# Altium schematic sheet power_gateway.SchDoc
size A4; SheetNumber: 1; SheetTotal: 2
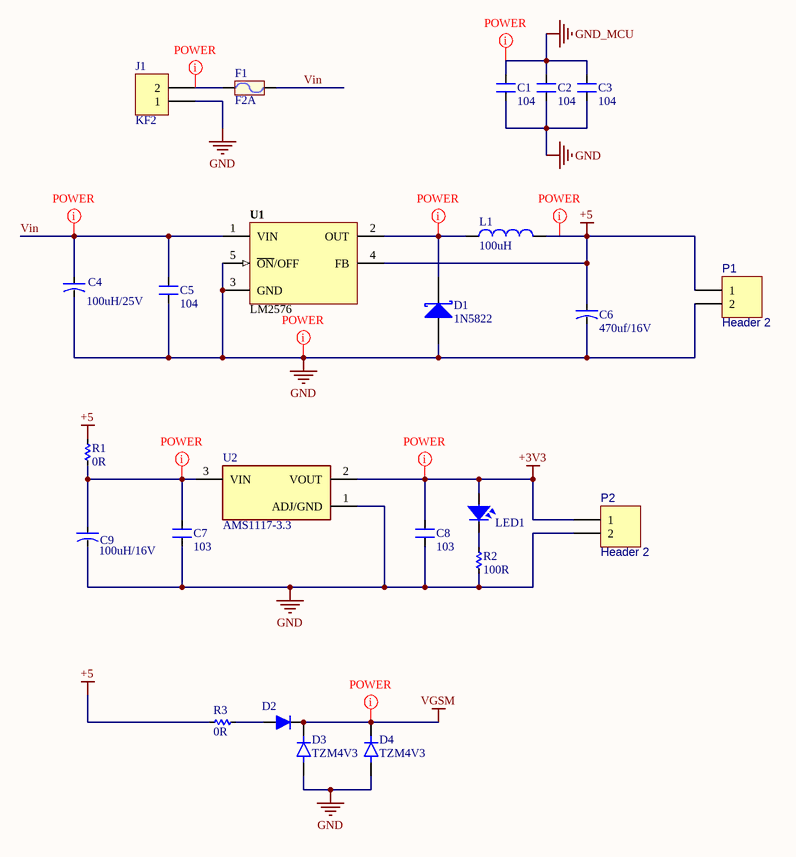
[diagram p0: power_gateway.SchDoc]

## Parts
C1  104  [SM-0805]
C2  104  [SM-0805]
C3  104  [SM-0805]
C4  100uH/25V  [CAP-ALU-SMD-6.3x7.7x2.2]
C5  104  [SM-0805]
C6  470uf/16V  [CAP-ALU-SMD-6.3x7.7x2.2]
C7  103  [SM-0805]
C8  103  [SM-0805]
C9  100uH/16V  [CAP-ALU-SMD-6.3x7.7x2.2]
D1  1N5822  [Diode_SS34]
D2  (no value)  [1N4007_SMD]
D3  TZM4V3  [DIO_LL4148]
D4  TZM4V3  [DIO_LL4148]
F1  F2A  [FUSE2]
J1  KF2  [KF2-5.08]
L1  value 100uH  [inductor_smd]  (hidden comment: Inductor)
LED1  LED  [LED-0805-Green]  (value not drawn)
P1  Header 2  [HDR1X2]
P2  Header 2  [HDR1X2]
R1  0R  [RES-SMD-0805]
R2  100R  [RES-SMD-0805]
R3  0R  [RES-SMD-0805]
U1  LM2576  [TO263]
U2  AMS1117-3.3  [SOT229P700X180-4N]

## Nets
+3V3: C8.1 LED1.1 P2.1 U2.2(VOUT)
+5: C6.1 L1.2 P1.1 R1.1 R3.1 U1.4(FB)
GND: C1.1 C2.1 C3.1 C4.2 C5.2 C6.2 C7.2 C8.2 C9.2 D1.1(A) D3.A D4.A J1.1 P1.2 P2.2 R2.2 U1.3(GND) U1.5(~{ON}/OFF) U2.1(ADJ/GND)
GND_MCU: C1.2 C2.2 C3.2
VGSM: D2.2 D3.C D4.C
Vin: C4.1 C5.1 F1.2 U1.1(VIN)
NetC7_1: C7.1 C9.1 R1.2 U2.3(VIN)
NetD1_2: D1.2(K) L1.1 U1.2(OUT)
NetD2_1: D2.1 R3.2
NetF1_1: F1.1 J1.2
NetLED1_2: LED1.2 R2.1

## Layout directives
net class POWER: +3V3, +5, GND, GND_MCU, NetC7_1, NetD1_2, NetF1_1, VGSM, Vin

## Library data of the parts
C1-C3 C5 = CM: Cap SMD; Value: 103
C4 C6 C9 = CN-ALU-SMD: Polarized Capacitor (Axial); Published: 8-Jun-2000; LatestRevisionDate: 17-Jul-2002; LatestRevisionNote: Re-released for DXP Platform.; PackageReference: POLAR0.8; Publisher: Altium Limited
C7 C8 = CM: Cap SMD; Value: 103
D1 = 1N5819: Schottky diode
D2 = diode
D3 D4 = LL4148: Diode Standard 100V 200mA Surface Mount SOD-80; MF: ON Semiconductor; Package: SOD-80 Taitron; Availability: Unavailable; MP: LL4148; Value: *; SnapEDA_Link: https://www.snapeda.com/parts/LL4148/ON%20Semiconductor/view-part/2182678/?ref=snap; Price: None
F1 = Fuse: Designed by: VanDungEvn; Value: Fuse
J1 = KF2: Manufacturer: Würth Elektronik eiSos GmbH; partNo: 691103110002; ComponentLink1 Description: Manufacturer; ComponentLink2 Description: Datasheet; NoPins: 2; Created Date: 29 October 2013; ComponentLink1URL: http://www.we-online.com; ComponentLink2URL: http://katalog.we-online.de/em/datasheet/6911031100xx.pdf; Created by: Karrer Zheng
LED1 = LED SMD: Value: LED 3 - 5 ly 2 Colour
P1 P2 = Header 2: Header, 2-Pin; LatestRevisionDate: 17-Jul-2002; LatestRevisionNote: Re-released for DXP Platform.; Publisher: Altium Limited
R1-R3 = Res-SMD: Resistor; Manufacturer: Generic Components; Class: Passive; Published: 08/06/2000; Publisher: Altium Hobart Technology Centre
U1 = LM2576: Max Input Voltage: 12 V; Max Output Current: 3 (6.0 peak) A; Max Output Voltage: mV; Category: IC-Power; Min Input Voltage: mV; Min Output Voltage: mV; Mounting Technology: Surface Mount; Status: Unreleased; Supply Voltage: mV; Temperature Range: -40 to +125 degC
U2 = AMS1117-3.3: Sot223/Pkg 1-Amp 3.3-Volt Low Drop Out Voltage Regulatator; MF: Advanced Monolithic Systems; Price: None; Package: None; Value: *; MP: AMS1117-3.3; Availability: Unavailable; SnapEDA_Link: https://www.snapeda.com/parts/AMS1117-3.3/Advanced%20Monolithic%20Systems/view-part/53450/?ref=snap
L1 = Inductor: Published: 8-Jun-2000; Revision: July-2002: Re-released for DXP Platform.; Publisher: Altium Limited